# Altium schematic sheet 4PWR_VFAT_OCT1.SchDoc
size 297 x 209 mm
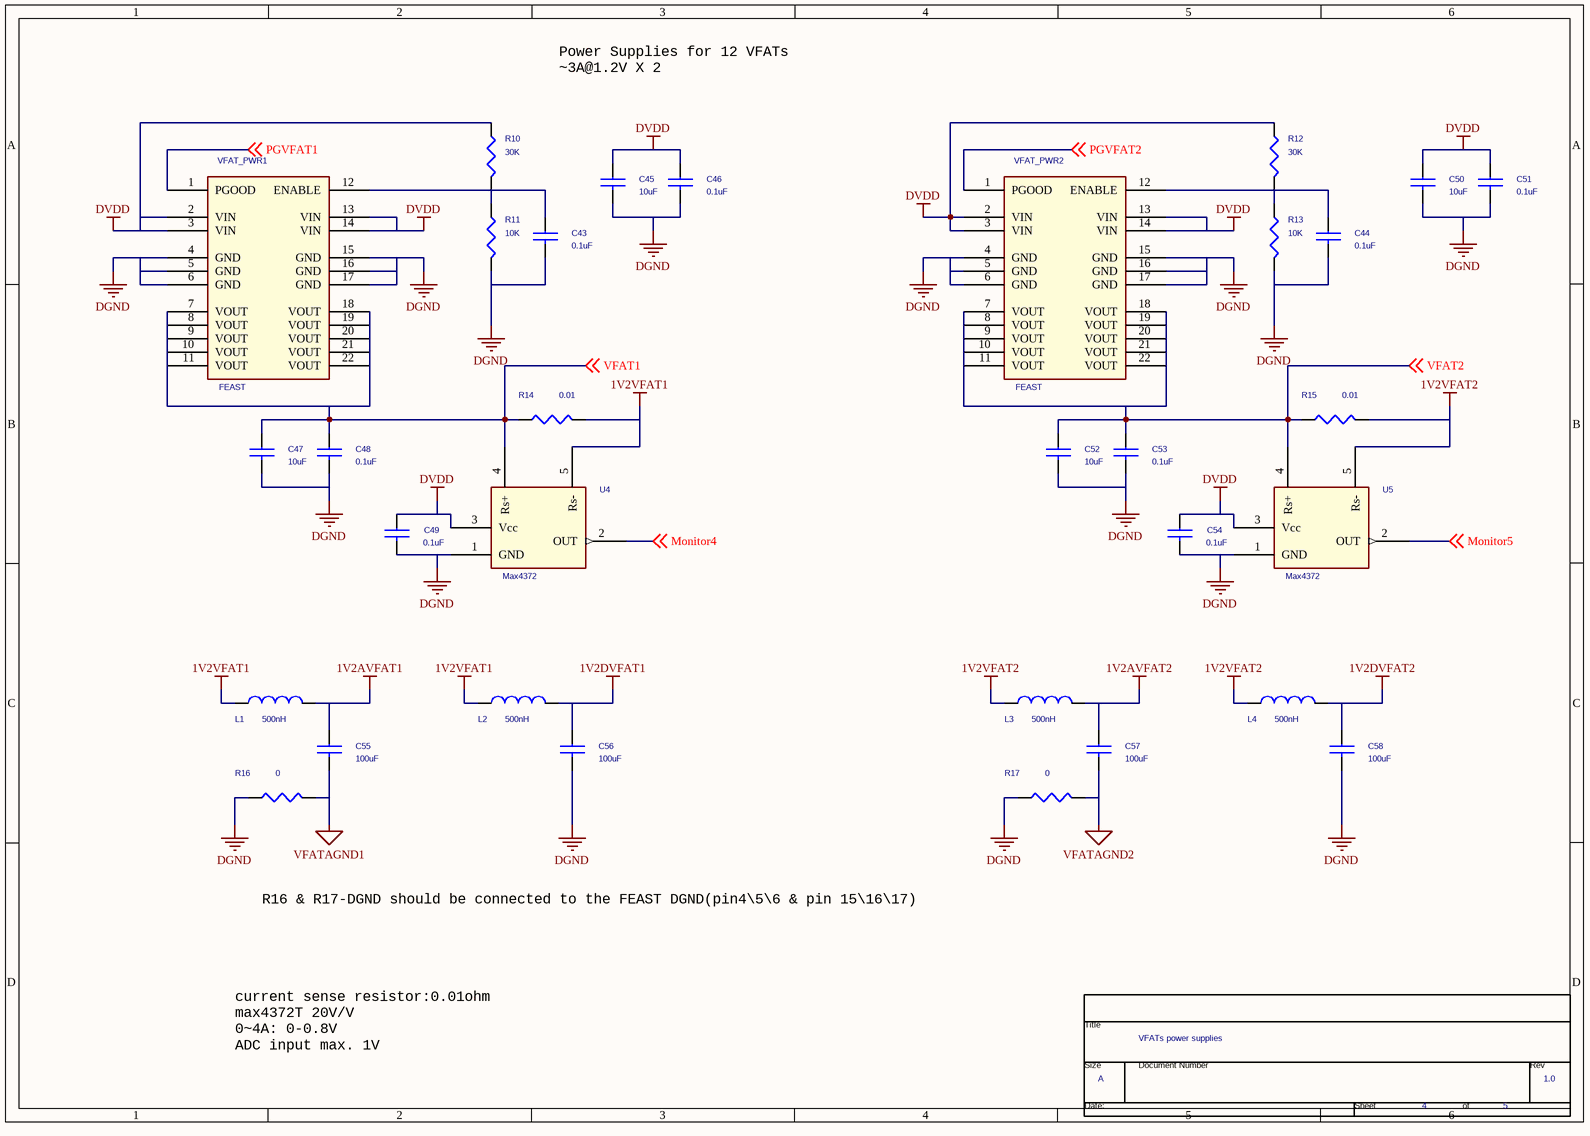
[diagram p0: 4PWR_VFAT_OCT1.SchDoc]

## Parts
*  Page Count: 5  Page Number: 4  Page Size: A  Title: VFATs power supplies  RevCode: 1.0  (hidden comment: TitleBlock0)  (graphical)
C43  0.1uF  [C0603]
C44  0.1uF  [C0603]
C45  10uF  [C1206]
C46  0.1uF  [C0603]
C47  10uF  [C1206]
C48  0.1uF  [C0603]
C49  0.1uF  [C0603]
C50  10uF  [C1206]
C51  0.1uF  [C0603]
C52  10uF  [C1206]
C53  0.1uF  [C0603]
C54  0.1uF  [C0603]
C55  100uF  [C1210]
C56  100uF  [C1210]
C57  100uF  [C1210]
C58  100uF  [C1210]
L1  500nH  [L500nH]
L2  500nH  [L500nH]
L3  500nH  [L500nH]
L4  500nH  [L500nH]
R10  30K  [R0603]
R11  10K  [R0603]
R12  30K  [R0603]
R13  10K  [R0603]
R14  0.01  [Rsense]
R15  0.01  [Rsense]
R16  0  [R1206]
R17  0  [R1206]
U4  Max4372  [sot23-5]
U5  Max4372  [sot23-5]
VFAT_PWR1  FEAST  [FW-11-03-L-D-264-090-A]
VFAT_PWR2  FEAST  [FW-11-03-L-D-264-090-A]

## Nets
1V2AVFAT1: C55.1 L1.2
1V2AVFAT2: C57.1 L3.2
1V2DVFAT1: C56.1 L2.2
1V2DVFAT2: C58.1 L4.2
1V2VFAT1: L1.1 L2.1 R14.2 U4.5(Rs-)
1V2VFAT2: L3.1 L4.1 R15.2 U5.5(Rs-)
DGND: C43.2 C44.2 C45.2 C46.2 C47.2 C48.2 C49.2 C50.2 C51.2 C52.2 C53.2 C54.2 C56.2 C58.2 R11.2 R13.2 R16.1 R17.1 U4.1(GND) U5.1(GND) VFAT_PWR1.4(GND) VFAT_PWR1.5(GND) VFAT_PWR1.6(GND) VFAT_PWR1.15(GND) VFAT_PWR1.16(GND) VFAT_PWR1.17(GND) VFAT_PWR2.4(GND) VFAT_PWR2.5(GND) VFAT_PWR2.6(GND) VFAT_PWR2.15(GND) VFAT_PWR2.16(GND) VFAT_PWR2.17(GND)
DVDD: C45.1 C46.1 C49.1 C50.1 C51.1 C54.1 R10.1 R12.1 U4.3(Vcc) U5.3(Vcc) VFAT_PWR1.2(VIN) VFAT_PWR1.3(VIN) VFAT_PWR1.13(VIN) VFAT_PWR1.14(VIN) VFAT_PWR2.2(VIN) VFAT_PWR2.3(VIN) VFAT_PWR2.13(VIN) VFAT_PWR2.14(VIN)
VFATAGND1: C55.2 R16.2
VFATAGND2: C57.2 R17.2
Monitor4: U4.2(OUT) ; off-sheet Monitor4
Monitor5: U5.2(OUT) ; off-sheet Monitor5
PGVFAT1: VFAT_PWR1.1(PGOOD) ; off-sheet PGVFAT1
PGVFAT2: VFAT_PWR2.1(PGOOD) ; off-sheet PGVFAT2
VFAT1: C47.1 C48.1 R14.1 U4.4(Rs+) VFAT_PWR1.7(VOUT) VFAT_PWR1.8(VOUT) VFAT_PWR1.9(VOUT) VFAT_PWR1.10(VOUT) VFAT_PWR1.11(VOUT) VFAT_PWR1.18(VOUT) VFAT_PWR1.19(VOUT) VFAT_PWR1.20(VOUT) VFAT_PWR1.21(VOUT) VFAT_PWR1.22(VOUT) ; off-sheet VFAT1
VFAT2: C52.1 C53.1 R15.1 U5.4(Rs+) VFAT_PWR2.7(VOUT) VFAT_PWR2.8(VOUT) VFAT_PWR2.9(VOUT) VFAT_PWR2.10(VOUT) VFAT_PWR2.11(VOUT) VFAT_PWR2.18(VOUT) VFAT_PWR2.19(VOUT) VFAT_PWR2.20(VOUT) VFAT_PWR2.21(VOUT) VFAT_PWR2.22(VOUT) ; off-sheet VFAT2
NetC43_1: C43.1 R10.2 R11.1 VFAT_PWR1.12(ENABLE)
NetC44_1: C44.1 R12.2 R13.1 VFAT_PWR2.12(ENABLE)

## Notes on the sheet
- Power Supplies for 12 VFATs
  ~3A@1.2V X 2
- R16 & R17-DGND should be connected to the FEAST DGND(pin4\5\6 & pin 15\16\17)
- current sense resistor:0.01ohm
  max4372T 20V/V
  0~4A: 0-0.8V
  ADC input max. 1V
- (in symbol TitleBlock0) Title; Size; Document Number; Rev; Date:; Sheet; of

## Library data of the parts
C43-C58 = CAP NP
L1-L4 = INDUCTOR
R10-R17 = R_Dup1
* = TitleBlock0: Page Create Date: March  8, 1995